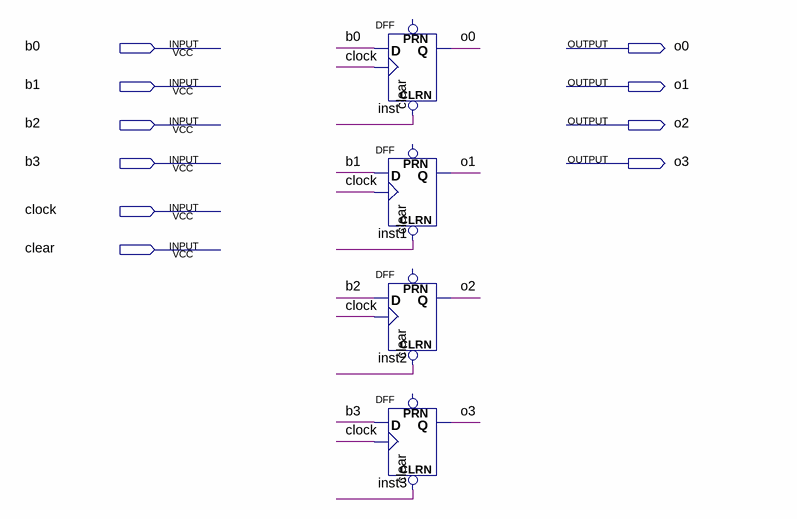
[diagram p0: schematic sheet]
// Quartus schematic register.bdf as structural Verilog: 4 symbols, 10 pins
module register (
  input  b0,
  input  b1,
  input  b2,
  input  b3,
  input  clock,
  input  clear,
  output o0,
  output o1,
  output o2,
  output o3
);

  DFF inst (.CLRN(clear), .CLK(clock), .D(b0), .Q(o0));  // open: PRN
  DFF inst1 (.CLRN(clear), .CLK(clock), .D(b1), .Q(o1));  // open: PRN
  DFF inst2 (.CLRN(clear), .CLK(clock), .D(b2), .Q(o2));  // open: PRN
  DFF inst3 (.CLRN(clear), .CLK(clock), .D(b3), .Q(o3));  // open: PRN
endmodule
